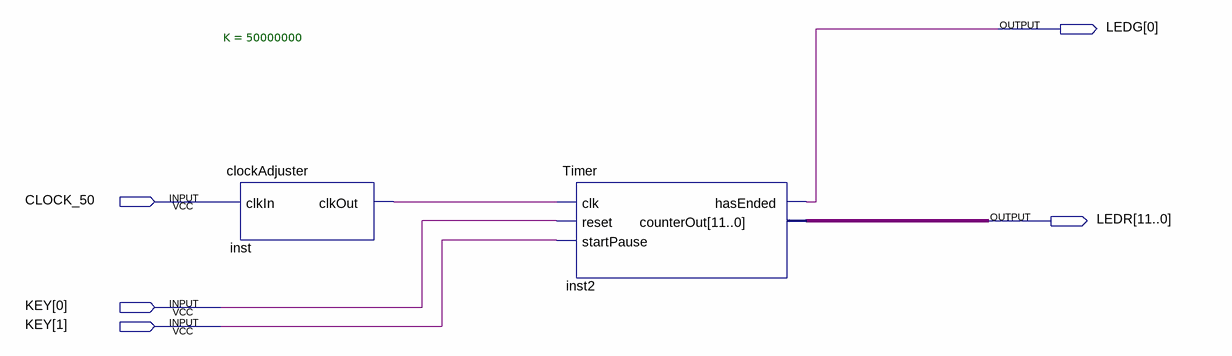
[diagram p0: schematic sheet]
// Quartus schematic Fase1.bdf as structural Verilog: 2 symbols, 5 pins
module Fase1 (
  input  CLOCK_50,
  input  [1:0] KEY,
  output [0:0] LEDG,
  output [11:0] LEDR
);

  wire inst_clkout;

  clockAdjuster #(.K(50000000)) inst (.clkIn(CLOCK_50), .clkOut(inst_clkout));
  Timer inst2 (.clk(inst_clkout), .reset(KEY[0]), .startPause(KEY[1]), .hasEnded(LEDG[0]), .counterOut(LEDR));
endmodule
